# Altium schematic sheet Isolated_Bias.SchDoc
size B
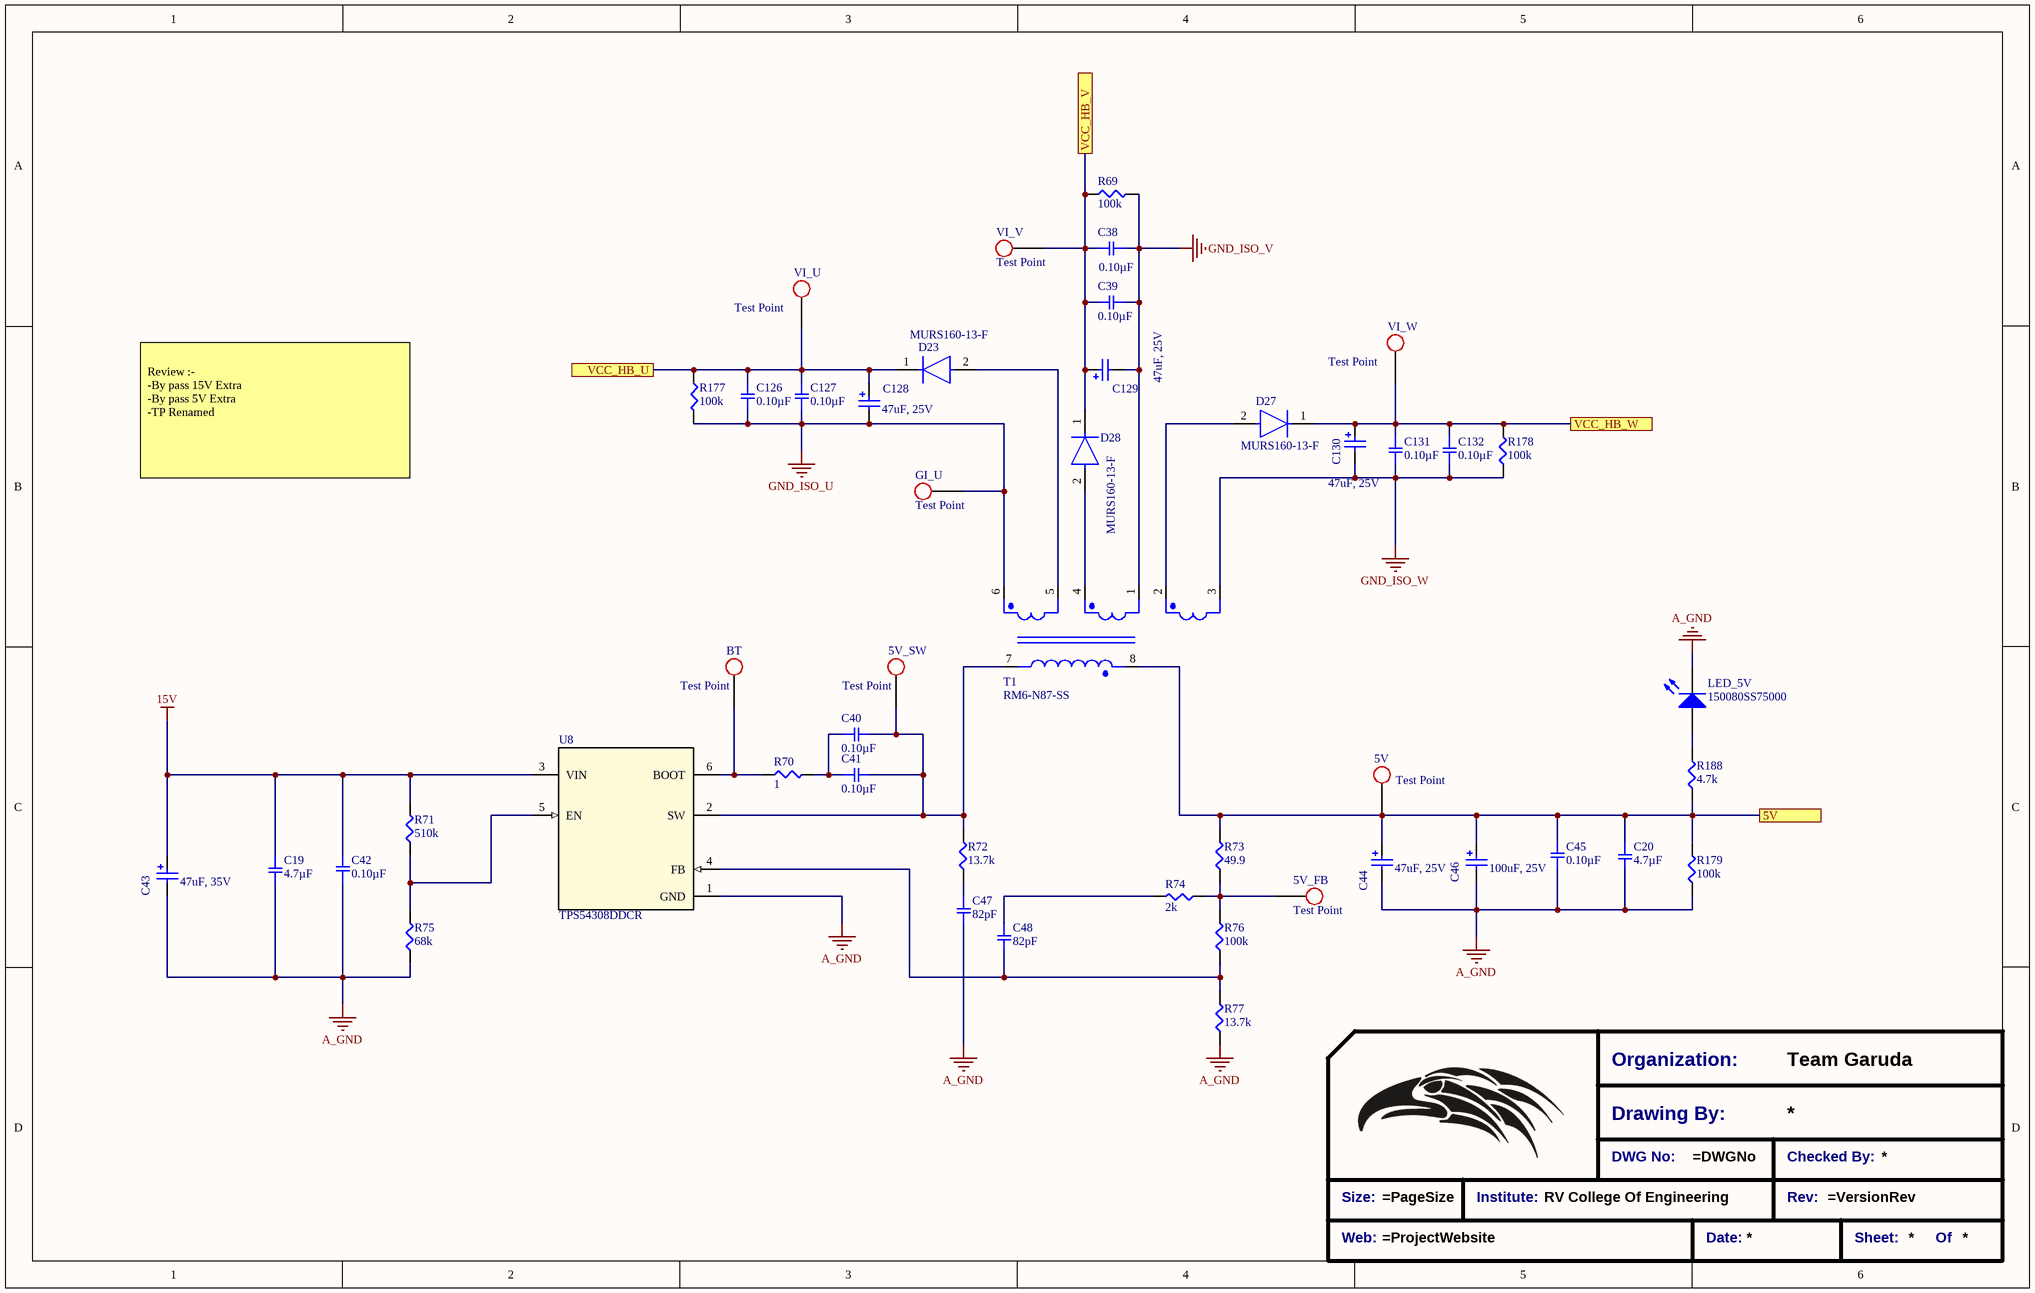
[diagram p0: Isolated_Bias.SchDoc]

## Parts
5V  Test Point  [Test_point_THT]  (no BOM)
5V_FB  Test Point  [Test_point_THT]  (no BOM)
5V_SW  Test Point  [Test_point_THT]  (no BOM)
*?  Title_Block  (value not drawn)  (graphical)
BT  Test Point  [Test_point_THT]  (no BOM)
C19  4.7µF  [SMD-1206C]
C20  4.7µF  [SMD-1206C]
C38  0.10µF  [SMD-0603C]
C39  0.10µF  [SMD-0805C]
C40  0.10µF  [SMD-0805C]
C41  0.10µF  [SMD-0805C]
C42  0.10µF  [SMD-0805C]
C43  47uF, 35V  [WCAP-ASLL_6.3x5.5]
C44  47uF, 25V  [WCAP-ASLL_6.3x5.5]
C45  0.10µF  [SMD-0603C]
C46  100uF, 25V  [WCAP-ASLU_8x6.5]
C47  82pF  [SMD-0805C]
C48  82pF  [SMD-0805C]
C126  0.10µF  [SMD-0805C]
C127  0.10µF  [SMD-0603C]
C128  47uF, 25V  [WCAP-ASLL_6.3x5.5]
C129  47uF, 25V  [WCAP-ASLL_6.3x5.5]
C130  47uF, 25V  [WCAP-ASLL_6.3x5.5]
C131  0.10µF  [SMD-0805C]
C132  0.10µF  [SMD-0603C]
D23  MURS160-13-F  [FP-SMB-MFG]
D27  MURS160-13-F  [FP-SMB-MFG]
D28  MURS160-13-F  [FP-SMB-MFG]
GI_U  Test Point  [Test_point_THT]  (no BOM)
LED_5V  150080SS75000  [0805_A]
R69  100k  [SMD-1206-RES]
R70  1  [SMD-0603-RES]
R71  510k  [SMD-0603-RES]
R72  13.7k  [SMD-0603-RES]
R73  49.9  [SMD-0603-RES]
R74  2k  [SMD-0603-RES]
R75  68k  [SMD-0603-RES]
R76  100k  [SMD-0603-RES]
R77  13.7k  [SMD-0603-RES]
R177  100k  [SMD-1206-RES]
R178  100k  [SMD-1206-RES]
R179  100k  [SMD-1206-RES]
R188  4.7k  [SMD-0805-RES]
T1  RM6-N87-SS  [RM6-N87-SS]
U8  TPS54308DDCR  [SOT95P278X110-6N]
VI_U  Test Point  [Test_point_THT]  (no BOM)
VI_V  Test Point  [Test_point_THT]  (no BOM)
VI_W  Test Point  [Test_point_THT]  (no BOM)

## Ports
5V, VCC_HB_U, VCC_HB_V, VCC_HB_W

## Nets
15V: C19.1 C42.2 C43.2(P) R71.2 U8.3(VIN)
A_GND: C19.2 C20.2 C42.1 C43.1(N) C44.1(N) C45.1 C46.1(N) C47.2 LED_5V.1(K) R75.1 R77.1 R179.1 U8.1(GND)
GND_ISO_U: C126.1 C127.1 C128.1(N) GI_U.1 R177.2 T1.6
GND_ISO_V: C38.1 C39.1 C129.1(N) R69.2 T1.1
GND_ISO_W: C130.1(N) C131.1 C132.1 R178.1 T1.3
5V: 5V.1 C20.1 C44.2(P) C45.2 C46.2(P) R73.2 R179.2 R188.1 T1.8 ; port 5V
VCC_HB_U: C126.2 C127.2 C128.2(P) D23.1(C) R177.1 VI_U.1 ; port VCC_HB_U
VCC_HB_V: C38.2 C39.2 C129.2(P) D28.1(C) R69.1 VI_V.1 ; port VCC_HB_V
VCC_HB_W: C130.2(P) C131.2 C132.2 D27.1(C) R178.2 VI_W.1 ; port VCC_HB_W
Net5V_FB_1: 5V_FB.1 R73.1 R74.1 R76.2
Net5V_SW_1: 5V_SW.1 C40.2 C41.2 R72.2 T1.7 U8.2(SW)
NetBT_1: BT.1 R70.1 U8.6(BOOT)
NetC40_1: C40.1 C41.1 R70.2
NetC47_1: C47.1 R72.1
NetC48_1: C48.1 R74.2
NetC48_2: C48.2 R76.1 R77.2 U8.4(FB)
NetD23_2: D23.2(A) T1.5
NetD27_2: D27.2(A) T1.2
NetD28_2: D28.2(A) T1.4
NetLED_5V_2: LED_5V.2(A) R188.2
NetR71_1: R71.1 R75.2 U8.5(EN)

## Notes on the sheet
- Review :-
  -By pass 15V Extra
  -By pass 5V Extra
  -TP Renamed
- (in symbol Title_Block) Organization:; Team Garuda; Drawing By:; DWG No:; Checked By:; Size:; Institute:; RV College Of Engineering; Rev:; Web:; Date:; Sheet:; Of

## Library data of the parts
*? = Title_Block: Standard Title Block
C19 C20 = GCJ31CR71E475KA12L: CAP CER 4.7UF 25V X7R 1206; Manufacturer: Murata Electronics North America; Factory Stock: 0; Unit Price (USD): 0.65; Minimum Quantity: 1; Tolerance: ±10%; Datasheets: http://www.murata.com/~/media/webrenewal/support/library/catalog/products/capacitor/mlcc/c03e.ashx; Image: //media.digikey.com/Renders/Murata%20Renders/GR331BD72E473KW01L.jpg; Digi-Key Part Number: 490-5808-1-ND; Part Number: GCJ31CR71E475KA12L; Quantity Available: 31743; @ qty: 0; Packaging: Cut Tape (CT); Series: GCJ; Part Status: Active; Value: 4.7µF; Voltage: 25V; Temperature Coefficient: X7R; Operating Temperature: -55°C ~ 125°C; Features: Soft Termination; Ratings: AEC-Q200; Applications: Automotive, Boardflex Sensitive; Mounting Type: Surface Mount, MLCC; Package / Case: 1206 (3216 Metric); Size / Dimension: 0.126" L x 0.063" W (3.20mm x 1.60mm); Height - Seated (Max): -; Thickness (Max): 0.075" (1.90mm); Lead Spacing: -; Lead Style: -
C38 C45 C127 C132 = GCM188R71C104KA37D: CAP CER 0.1UF 16V X7R 0603; Manufacturer: Murata Electronics North America; Factory Stock: 0; Unit Price (USD): 0.18; Minimum Quantity: 1; Tolerance: ±10%; Datasheets: http://www.murata.com/~/media/webrenewal/support/library/catalog/products/capacitor/mlcc/c03e.ashx; Image: //media.digikey.com/Renders/Murata%20Renders/0603%28GCM188%29.jpg; Digi-Key Part Number: 490-4774-1-ND; Part Number: GCM188R71C104KA37D; Quantity Available: 284085; @ qty: 0; Packaging: Cut Tape (CT); Series: GCM; Part Status: Active; Value: 0.10µF; Voltage: 16V; Temperature Coefficient: X7R; Operating Temperature: -55°C ~ 125°C; Features: -; Ratings: AEC-Q200; Applications: Automotive; Mounting Type: Surface Mount, MLCC; Package / Case: 0603 (1608 Metric); Size / Dimension: 0.063" L x 0.031" W (1.60mm x 0.80mm); Height - Seated (Max): -; Thickness (Max): 0.035" (0.90mm); Lead Spacing: -; Lead Style: -
C39-C42 C126 C131 = GCD21BR71H104KA01L: CAP CER 0.1UF 50V X7R 0805; Manufacturer: Murata Electronics North America; Factory Stock: 0; Unit Price (USD): 0.24; Minimum Quantity: 1; Tolerance: ±10%; Datasheets: http://www.murata.com/~/media/webrenewal/support/library/catalog/products/capacitor/mlcc/c03e.ashx; Image: //media.digikey.com/Renders/Murata%20Renders/0805%28GxM6%29.jpg; Digi-Key Part Number: 490-11955-1-ND; Part Number: GCD21BR71H104KA01L; Quantity Available: 157; @ qty: 0; Packaging: Cut Tape (CT); Series: GCD; Part Status: Active; Value: 0.10µF; Voltage: 50V; Temperature Coefficient: X7R; Operating Temperature: -55°C ~ 125°C; Features: -; Ratings: AEC-Q200; Applications: Automotive; Mounting Type: Surface Mount, MLCC; Package / Case: 0805 (2012 Metric); Size / Dimension: 0.079" L x 0.049" W (2.00mm x 1.25mm); Height - Seated (Max): -; Thickness (Max): 0.049" (1.25mm); Lead Spacing: -; Lead Style: -
C43 = 865060543005: WCAP-ASLL SMT Aluminum Electrolytic Capacitors, D6.3mm x L5.5mm, 47uF, +/-20%, 35VDC; Dissipation Factor: 14%; Endurance: 2000h; Leakage Current: 16.45uA; Ripple Current max.: 240mA; Technical Reference: ASED055470M035DVCTBB000; ComponentLink1Description: Manufacturer; ComponentLink1URL: http://www.we-online.de; ComponentLink2Description: Datasheet; ComponentLink2URL: https://katalog.we-online.com/pbs/datasheet/865060543005.pdf; Length: 5.5mm; Mounting Technology: SMT; Operating Temperature: -55 to +105degC; Packaging: Tape and Reel; Published Date: August 2019; Capacitance: 47uF; Diameter: 6.3mm; Part Number: 865060543005; Publisher: Wurth Elektronik; Capacitance Tolerance: +/-20%; Rated Voltage: 35VDC
C44 C128-C130 = 865060443004: WCAP-ASLL SMT Aluminum Electrolytic Capacitors, D6.3mm x L5.5mm, 47uF, +/-20%, 25VDC; Dissipation Factor: 14%; Endurance: 2000h; Leakage Current: 11.75uA; Ripple Current max.: 230mA; Technical Reference: ASED055470M025DVCTBB000; ComponentLink1Description: Manufacturer; ComponentLink1URL: http://www.we-online.de; ComponentLink2Description: Datasheet; ComponentLink2URL: https://katalog.we-online.com/pbs/datasheet/865060443004.pdf; Length: 5.5mm; Mounting Technology: SMT; Operating Temperature: -55 to +105degC; Packaging: Tape and Reel; Published Date: August 2019; Capacitance: 47uF; Diameter: 6.3mm; Part Number: 865060443004; Publisher: Wurth Elektronik; Capacitance Tolerance: +/-20%; Rated Voltage: 25VDC
C46 = 865090449009: WCAP-ASLU Aluminium Electrolytic Capacitors, D8mm x L6.5mm, 100uF, +/-20%, 25VDC; Dissipation Factor: 16%; Leakage Current: 5uA; Endurance: 1000h; Technical Reference: ASBE065101M025DVCTBA000; Ripple Current max.: 110mA; ComponentLink1Description: Manufacturer; ComponentLink1URL: http://www.we-online.de; ComponentLink2Description: Datasheet; ComponentLink2URL: https://katalog.we-online.com/pbs/datasheet/865090449009.pdf; Mounting Technology: SMD; Operating Temperature: -40 to +85degC; Packaging: Tape and Reel; Part Number: 865090449009; Publisher: Wurth Elektronik; Capacitance: 100uF; Diameter: 8mm; Length: 6.5mm; Published Date: August 2019; Rated Voltage: 25VDC; Capacitance Tolerance: +/-20%
C47 C48 = GQM2195C1H820JB01D: CAP CER 82PF 50V NP0 0805; Manufacturer: Murata Electronics North America; Factory Stock: 0; Unit Price (USD): 1.22; Minimum Quantity: 1; Tolerance: ±5%; Temperature Coefficient: C0G, NP0; Datasheets: http://www.murata.com/~/media/webrenewal/support/library/catalog/products/capacitor/mlcc/c02e.pdf; Image: //media.digikey.com/Renders/Murata%20Renders/0805(GxM9).jpg; Digi-Key Part Number: 490-3615-1-ND; Part Number: GQM2195C1H820JB01D; Quantity Available: 7488; @ qty: 0; Packaging: Cut Tape (CT); Series: GQM; Part Status: Active; Value: 82pF; Voltage: 50V; Operating Temperature: -55°C ~ 125°C; Features: High Q, Low Loss; Ratings: -; Applications: RF, Microwave, High Frequency; Mounting Type: Surface Mount, MLCC; Package / Case: 0805 (2012 Metric); Size / Dimension: 0.079" L x 0.049" W (2.00mm x 1.25mm); Height - Seated (Max): -; Thickness (Max): 0.037" (0.95mm); Lead Spacing: -; Lead Style: -
D23 D27 D28 = CMP-12791-000032-1: DIODE GEN PURP 600V 1A SMB; Manufacturer: Diodes Inc.; Standoff Height: 0.05mm; Max Surge Forward Current: 35A; Capacitance: 10pF; Peak Reverse Current: 5uA; Max Junction Temp: +150°C; Value: 10pF; Reverse Voltage: 600V; Device Class L1: Discrete Semiconductors; Lead Free: Yes; Temperature Range Low: -55°C; Mouser Description: Rectifier Super-Fast Recovery Gpp Smb 1.0A 600V Rohs 3K Rohs Compliant: Yes; Temperature: -55°C to +150°C; Category: Diode; Digikey Description: DIODE GEN PURP 600V 1A SMB; Height: 2.5mm; Manufacturer Part Number: MURS160-13-F; RoHS: TRUE; ComponentLink2Description: Datasheet; Octopart: https://octopart.com/murs160-13-f-diodes+inc.-332437; ComponentLink2URL: https://www.diodes.com/assets/Datasheets/ds30130.pdf; Automotive: No; Max Repetitive Reverse Voltage: 600V; Footprint Url: https://www.diodes.com/assets/Package-Files/SMB.pdf; Device Class L3: Rectifier Diodes; Temperature Range High: +150°C; Device Class L2: Diodes; Package: SMB; Forward Current: 1A
LED_5V = 150080SS75000: SMD mono-color Chip LED, WL-SMCW, Super Red; PackageReference: 0805_A; Color: Super Red; PartNumber: 150080SS75000; ComponentLink1Description: Manufacturer URL; ComponentLink1URL: http://www.we-online.com; ComponentLink2Description: Datasheet; ComponentLink2URL: http://katalog.we-online.com/led/datasheet/150080SS75000.pdf
R69 R177-R179 = ERJ-8ENF1003V: RES SMD 100K OHM 1% 1/4W 1206; Manufacturer: Panasonic Electronic Components; Factory Stock: 0; Unit Price (USD): 0.00933; @ qty: 1500; Minimum Quantity: 1; Power (Watts): 0.25W, 1/4W; Temperature Coefficient: ±100ppm/°C; Part Number: ERJ-8ENF1003V; Datasheets: http://industrial.panasonic.com/www-cgi/jvcr13pz.cgi?E+PZ+3+AOA0002+ERJ8ENF1003V+7+WW; Image: //media.digikey.com/Renders/Panasonic%20Renders/ERJ-1206%20Pkg.jpg; Digi-Key Part Number: P100KFCT-ND; Quantity Available: 576605; Packaging: Cut Tape (CT); Series: ERJ; Part Status: Active; Value: 100k; Tolerance: ±1%; Composition: Thick Film; Features: Automotive AEC-Q200; Operating Temperature: -55°C ~ 155°C; Package / Case: 1206 (3216 Metric); Supplier Device Package: 1206; Size / Dimension: 0.126" L x 0.063" W (3.20mm x 1.60mm); Height - Seated (Max): 0.028" (0.70mm); Number of Terminations: 2; Failure Rate: -
R70 = ERJ-3BQF1R0V: RES SMD 1 OHM 1% 1/4W 0603; Manufacturer: Panasonic Electronic Components; Factory Stock: 0; Unit Price (USD): 0.05386; @ qty: 1500; Power (Watts): 0.25W, 1/4W; Temperature Coefficient: ±200ppm/°C; Part Number: ERJ-3BQF1R0V; Datasheets: https://industrial.panasonic.com/cdbs/www-data/pdf/RDA0000/AOA0000C239.pdf; Image: //media.digikey.com/Photos/Panasonic%20Photos/MFG_ERJ-P6W%20Series.jpg; Digi-Key Part Number: P17371CT-ND; Quantity Available: 30514; Minimum Quantity: 1; Packaging: Cut Tape (CT); Series: ERJ; Part Status: Active; Value: 1; Tolerance: ±1%; Composition: Thick Film; Features: Automotive AEC-Q200, Current Sense; Operating Temperature: -55°C ~ 125°C; Package / Case: 0603 (1608 Metric); Supplier Device Package: 0603; Size / Dimension: 0.063" L x 0.031" W (1.60mm x 0.80mm); Height - Seated (Max): 0.022" (0.55mm); Number of Terminations: 2; Failure Rate: -
R71 = ERJ-3EKF5103V: RES SMD 510K OHM 1% 1/10W 0603; Manufacturer: Panasonic Electronic Components; Factory Stock: 0; Unit Price (USD): 0.00379; @ qty: 1500; Minimum Quantity: 1; Power (Watts): 0.1W, 1/10W; Temperature Coefficient: ±100ppm/°C; Part Number: ERJ-3EKF5103V; Datasheets: http://industrial.panasonic.com/www-cgi/jvcr13pz.cgi?E+PZ+3+AOA0002+ERJ3EKF5103V+7+WW; Image: //media.digikey.com/Photos/Panasonic%20Photos/MFG_ERJ-P6W%20Series.jpg; Digi-Key Part Number: P510KHCT-ND; Quantity Available: 132059; Packaging: Cut Tape (CT); Series: ERJ; Part Status: Active; Value: 510k; Tolerance: ±1%; Composition: Thick Film; Features: Automotive AEC-Q200; Operating Temperature: -55°C ~ 155°C; Package / Case: 0603 (1608 Metric); Supplier Device Package: 0603; Size / Dimension: 0.063" L x 0.031" W (1.60mm x 0.80mm); Height - Seated (Max): 0.022" (0.55mm); Number of Terminations: 2; Failure Rate: -
R72 R77 = ERJ-3EKF1372V: RES SMD 13.7K OHM 1% 1/10W 0603; Manufacturer: Panasonic Electronic Components; Factory Stock: 0; Unit Price (USD): 0.00379; @ qty: 1500; Minimum Quantity: 1; Power (Watts): 0.1W, 1/10W; Temperature Coefficient: ±100ppm/°C; Part Number: ERJ-3EKF1372V; Datasheets: http://industrial.panasonic.com/www-cgi/jvcr13pz.cgi?E+PZ+3+AOA0002+ERJ3EKF1372V+7+WW; Image: //media.digikey.com/Photos/Panasonic%20Photos/MFG_ERJ-P6W%20Series.jpg; Digi-Key Part Number: P13.7KHCT-ND; Quantity Available: 81314; Packaging: Cut Tape (CT); Series: ERJ; Part Status: Active; Value: 13.7k; Tolerance: ±1%; Composition: Thick Film; Features: Automotive AEC-Q200; Operating Temperature: -55°C ~ 155°C; Package / Case: 0603 (1608 Metric); Supplier Device Package: 0603; Size / Dimension: 0.063" L x 0.031" W (1.60mm x 0.80mm); Height - Seated (Max): 0.022" (0.55mm); Number of Terminations: 2; Failure Rate: -
R73 = ERJ-3EKF49R9V: RES SMD 49.9 OHM 1% 1/10W 0603; Manufacturer: Panasonic Electronic Components; Factory Stock: 0; Unit Price (USD): 0.00379; @ qty: 1500; Minimum Quantity: 1; Power (Watts): 0.1W, 1/10W; Temperature Coefficient: ±100ppm/°C; Part Number: ERJ-3EKF49R9V; Datasheets: http://industrial.panasonic.com/www-cgi/jvcr13pz.cgi?E+PZ+3+AOA0002+ERJ3EKF49R9V+7+WW; Image: //media.digikey.com/Photos/Panasonic%20Photos/MFG_ERJ-P6W%20Series.jpg; Digi-Key Part Number: P49.9HCT-ND; Quantity Available: 566023; Packaging: Cut Tape (CT); Series: ERJ; Part Status: Active; Value: 49.9; Tolerance: ±1%; Composition: Thick Film; Features: Automotive AEC-Q200; Operating Temperature: -55°C ~ 155°C; Package / Case: 0603 (1608 Metric); Supplier Device Package: 0603; Size / Dimension: 0.063" L x 0.031" W (1.60mm x 0.80mm); Height - Seated (Max): 0.022" (0.55mm); Number of Terminations: 2; Failure Rate: -
R74 = ERJ-3EKF2001V: RES SMD 2K OHM 1% 1/10W 0603; Manufacturer: Panasonic Electronic Components; Factory Stock: 0; Unit Price (USD): 0.00379; @ qty: 1500; Minimum Quantity: 1; Power (Watts): 0.1W, 1/10W; Temperature Coefficient: ±100ppm/°C; Part Number: ERJ-3EKF2001V; Datasheets: http://industrial.panasonic.com/www-cgi/jvcr13pz.cgi?E+PZ+3+AOA0002+ERJ3EKF2001V+7+WW; Image: //media.digikey.com/Photos/Panasonic%20Photos/MFG_ERJ-P6W%20Series.jpg; Digi-Key Part Number: P2.00KHCT-ND; Quantity Available: 1021544; Packaging: Cut Tape (CT); Series: ERJ; Part Status: Active; Value: 2k; Tolerance: ±1%; Composition: Thick Film; Features: Automotive AEC-Q200; Operating Temperature: -55°C ~ 155°C; Package / Case: 0603 (1608 Metric); Supplier Device Package: 0603; Size / Dimension: 0.063" L x 0.031" W (1.60mm x 0.80mm); Height - Seated (Max): 0.022" (0.55mm); Number of Terminations: 2; Failure Rate: -
R75 = ERJ-3EKF6802V: RES SMD 68K OHM 1% 1/10W 0603; Manufacturer: Panasonic Electronic Components; Factory Stock: 0; Unit Price (USD): 0.00379; @ qty: 1500; Minimum Quantity: 1; Power (Watts): 0.1W, 1/10W; Temperature Coefficient: ±100ppm/°C; Part Number: ERJ-3EKF6802V; Datasheets: http://industrial.panasonic.com/www-cgi/jvcr13pz.cgi?E+PZ+3+AOA0002+ERJ3EKF6802V+7+WW; Image: //media.digikey.com/Photos/Panasonic%20Photos/MFG_ERJ-P6W%20Series.jpg; Digi-Key Part Number: P68.0KHCT-ND; Quantity Available: 63788; Packaging: Cut Tape (CT); Series: ERJ; Part Status: Active; Value: 68k; Tolerance: ±1%; Composition: Thick Film; Features: Automotive AEC-Q200; Operating Temperature: -55°C ~ 155°C; Package / Case: 0603 (1608 Metric); Supplier Device Package: 0603; Size / Dimension: 0.063" L x 0.031" W (1.60mm x 0.80mm); Height - Seated (Max): 0.022" (0.55mm); Number of Terminations: 2; Failure Rate: -
R76 = ERJ-3GEYJ104V: RES SMD 100K OHM 5% 1/10W 0603; Manufacturer: Panasonic Electronic Components; Factory Stock: 0; Unit Price (USD): 0.00321; @ qty: 1500; Minimum Quantity: 1; Power (Watts): 0.1W, 1/10W; Temperature Coefficient: ±200ppm/°C; Part Number: ERJ-3GEYJ104V; Datasheets: http://industrial.panasonic.com/www-cgi/jvcr13pz.cgi?E+PZ+3+AOA0001+ERJ3GEYJ104V+7+WW; Image: //media.digikey.com/Photos/Panasonic%20Photos/MFG_ERJ-P6W%20Series.jpg; Digi-Key Part Number: P100KGCT-ND; Quantity Available: 1377078; Packaging: Cut Tape (CT); Series: ERJ; Part Status: Active; Value: 100k; Tolerance: ±5%; Composition: Thick Film; Features: Automotive AEC-Q200; Operating Temperature: -55°C ~ 155°C; Package / Case: 0603 (1608 Metric); Supplier Device Package: 0603; Size / Dimension: 0.063" L x 0.031" W (1.60mm x 0.80mm); Height - Seated (Max): 0.022" (0.55mm); Number of Terminations: 2; Failure Rate: -
R188 = ERJ-6ENF4701V: RES SMD 4.7K OHM 1% 1/8W 0805; Manufacturer: Panasonic Electronic Components; Factory Stock: 0; Unit Price (USD): 0.00729; @ qty: 1500; Minimum Quantity: 1; Power (Watts): 0.125W, 1/8W; Temperature Coefficient: ±100ppm/°C; Part Number: ERJ-6ENF4701V; Datasheets: http://industrial.panasonic.com/www-cgi/jvcr13pz.cgi?E+PZ+3+AOA0002+ERJ6ENF4701V+7+WW; Image: //media.digikey.com/Renders/Panasonic%20Renders/ERJ-0805%20Pkg.jpg; Digi-Key Part Number: P4.70KCCT-ND; Quantity Available: 312387; Packaging: Cut Tape (CT); Series: ERJ; Part Status: Active; Value: 4.7k; Tolerance: ±1%; Composition: Thick Film; Features: Automotive AEC-Q200; Operating Temperature: -55°C ~ 155°C; Package / Case: 0805 (2012 Metric); Supplier Device Package: 0805; Size / Dimension: 0.079" L x 0.049" W (2.00mm x 1.25mm); Height - Seated (Max): 0.028" (0.70mm); Number of Terminations: 2; Failure Rate: -
U8 = TPS54308DDCR: Imported; Manufacturer: Texas Instruments; PartNumber: TPS54308DDCR; RefDes: RefDes; Type: DEV; Value: Value; Manufacturer_Part_Number: TPS54308DDCR; Manufacturer_Name: Texas Instruments